# Altium project HM-13-Baseboard.PrjPcb
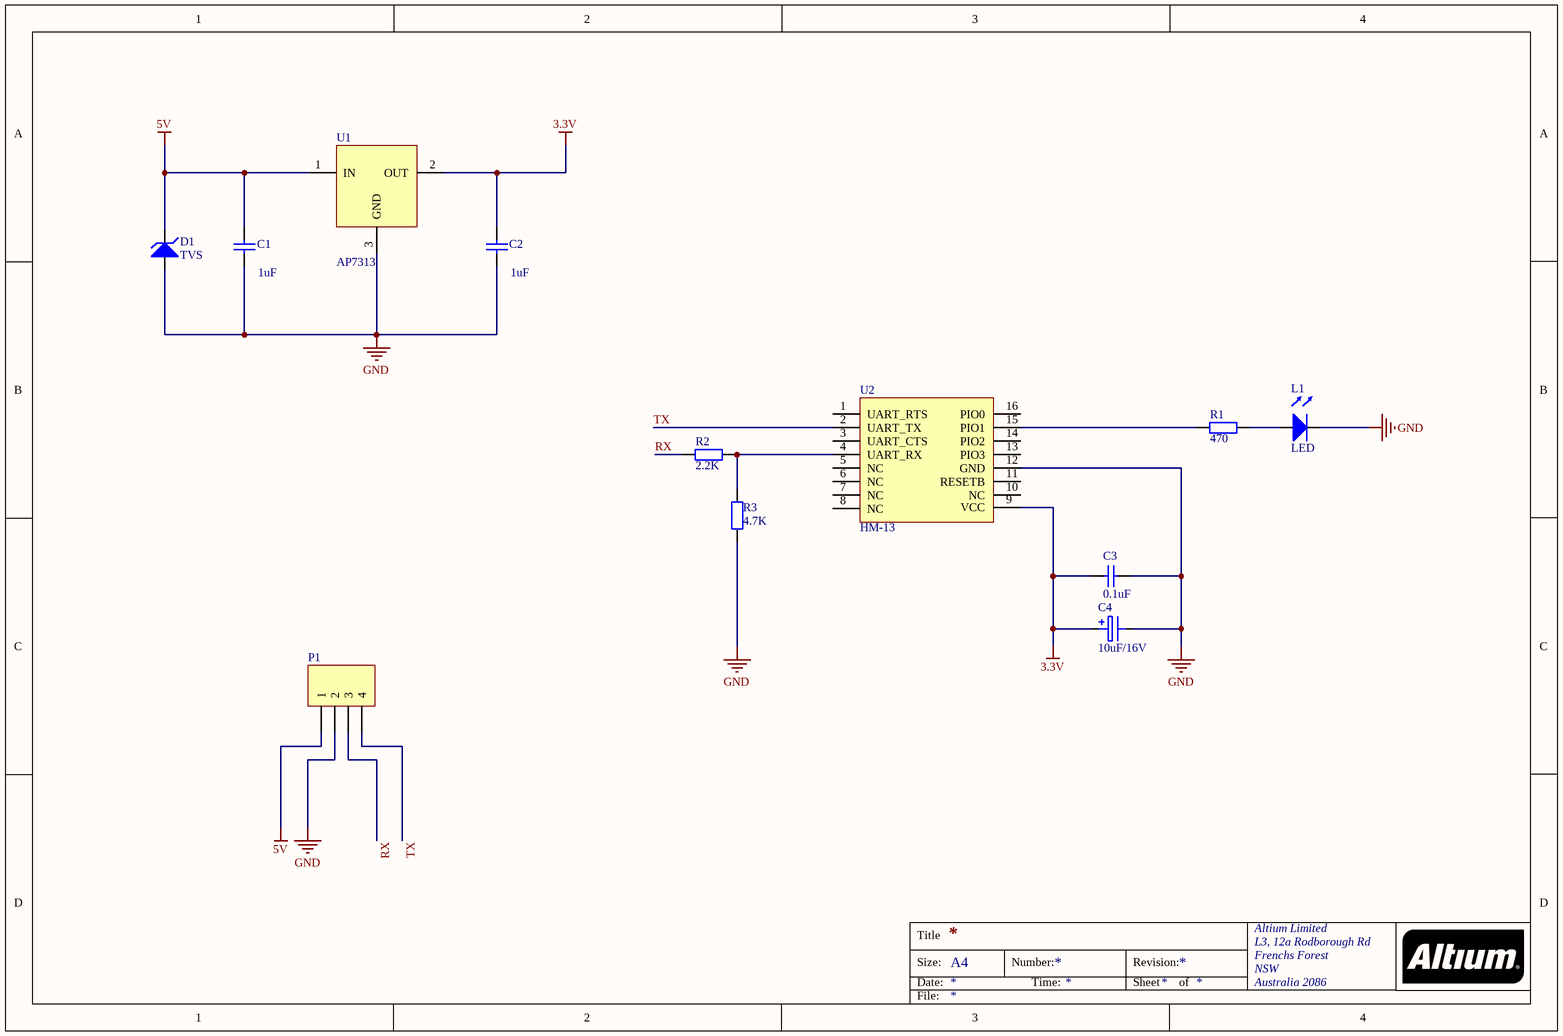
[diagram p0: HM-13.SchDoc]
1 sheet, 12 parts. Net scope: global (net labels, ports and power ports of the same name join across sheets).
Board files: HM-13-multiple.PcbDoc, HM-13.PcbDoc

## Sheet HM-13.SchDoc
size A4; Organization: Altium Limited; Address1: L3, 12a Rodborough Rd; Address2: Frenchs Forest; Address3: NSW; Address4: Australia 2086

### Parts
C1  1uF  [0603]
C2  1uF  [0603]
C3  0.1uF  [0603]
C4  10uF/16V  [1206]
D1  TVS  [DO214-AC]
L1  LED  [0805]
P1  Header 4  [HDR1X4]  (value not drawn)
R1  470  [0603]
R2  2.2K  [0603]
R3  4.7K  [0603]
U1  AP7313  [AP7313-33SAG-7]
U2  HM-13  [HM-13]

### Nets
3.3V: C2.2 C3.2 C4.1 U1.2(OUT) U2.9(VCC)
5V: C1.2 D1.2(K) P1.1 U1.1(IN)
GND: C1.1 C2.1 C3.1 C4.2 D1.1(A) L1.2(K) P1.2 R3.1 U1.3(GND) U2.12(GND)
RX: P1.3 R2.2
TX: P1.4 U2.2(UART_TX)
NetL1_1: L1.1(A) R1.2
NetR1_1: R1.1 U2.15(PIO1)
NetR2_1: R2.1 R3.2 U2.4(UART_RX)

Not connected (* = marked no-connect by the designer): U2 1(UART_RTS) 3(UART_CTS) 5(NC) 6(NC) 7(NC) 8(NC) 10(NC) 11(RESETB) 13(PIO3) 14(PIO2) 16(PIO0)

### Notes on the sheet
- Title
- Size:
- Date:
- A4
- Number:
- Time:
- Revision:
- Sheet
- of
- File:

### Library data of the parts
C1-C3 = Cap1: ceramic
C4 = Cap3: aluminum
D1 = 6V8A-TVS
P1 = Header 4: Header, 4-Pin; LatestRevisionDate: 17-Jul-2002; LatestRevisionNote: Re-released for DXP Platform.; Publisher: Altium Limited
R1-R3 = Res
U1 = AP7313-33SAG-7